# EAGLE design IMU Raspberry Pi Breakout RevB (EAGLE 9.6.2)
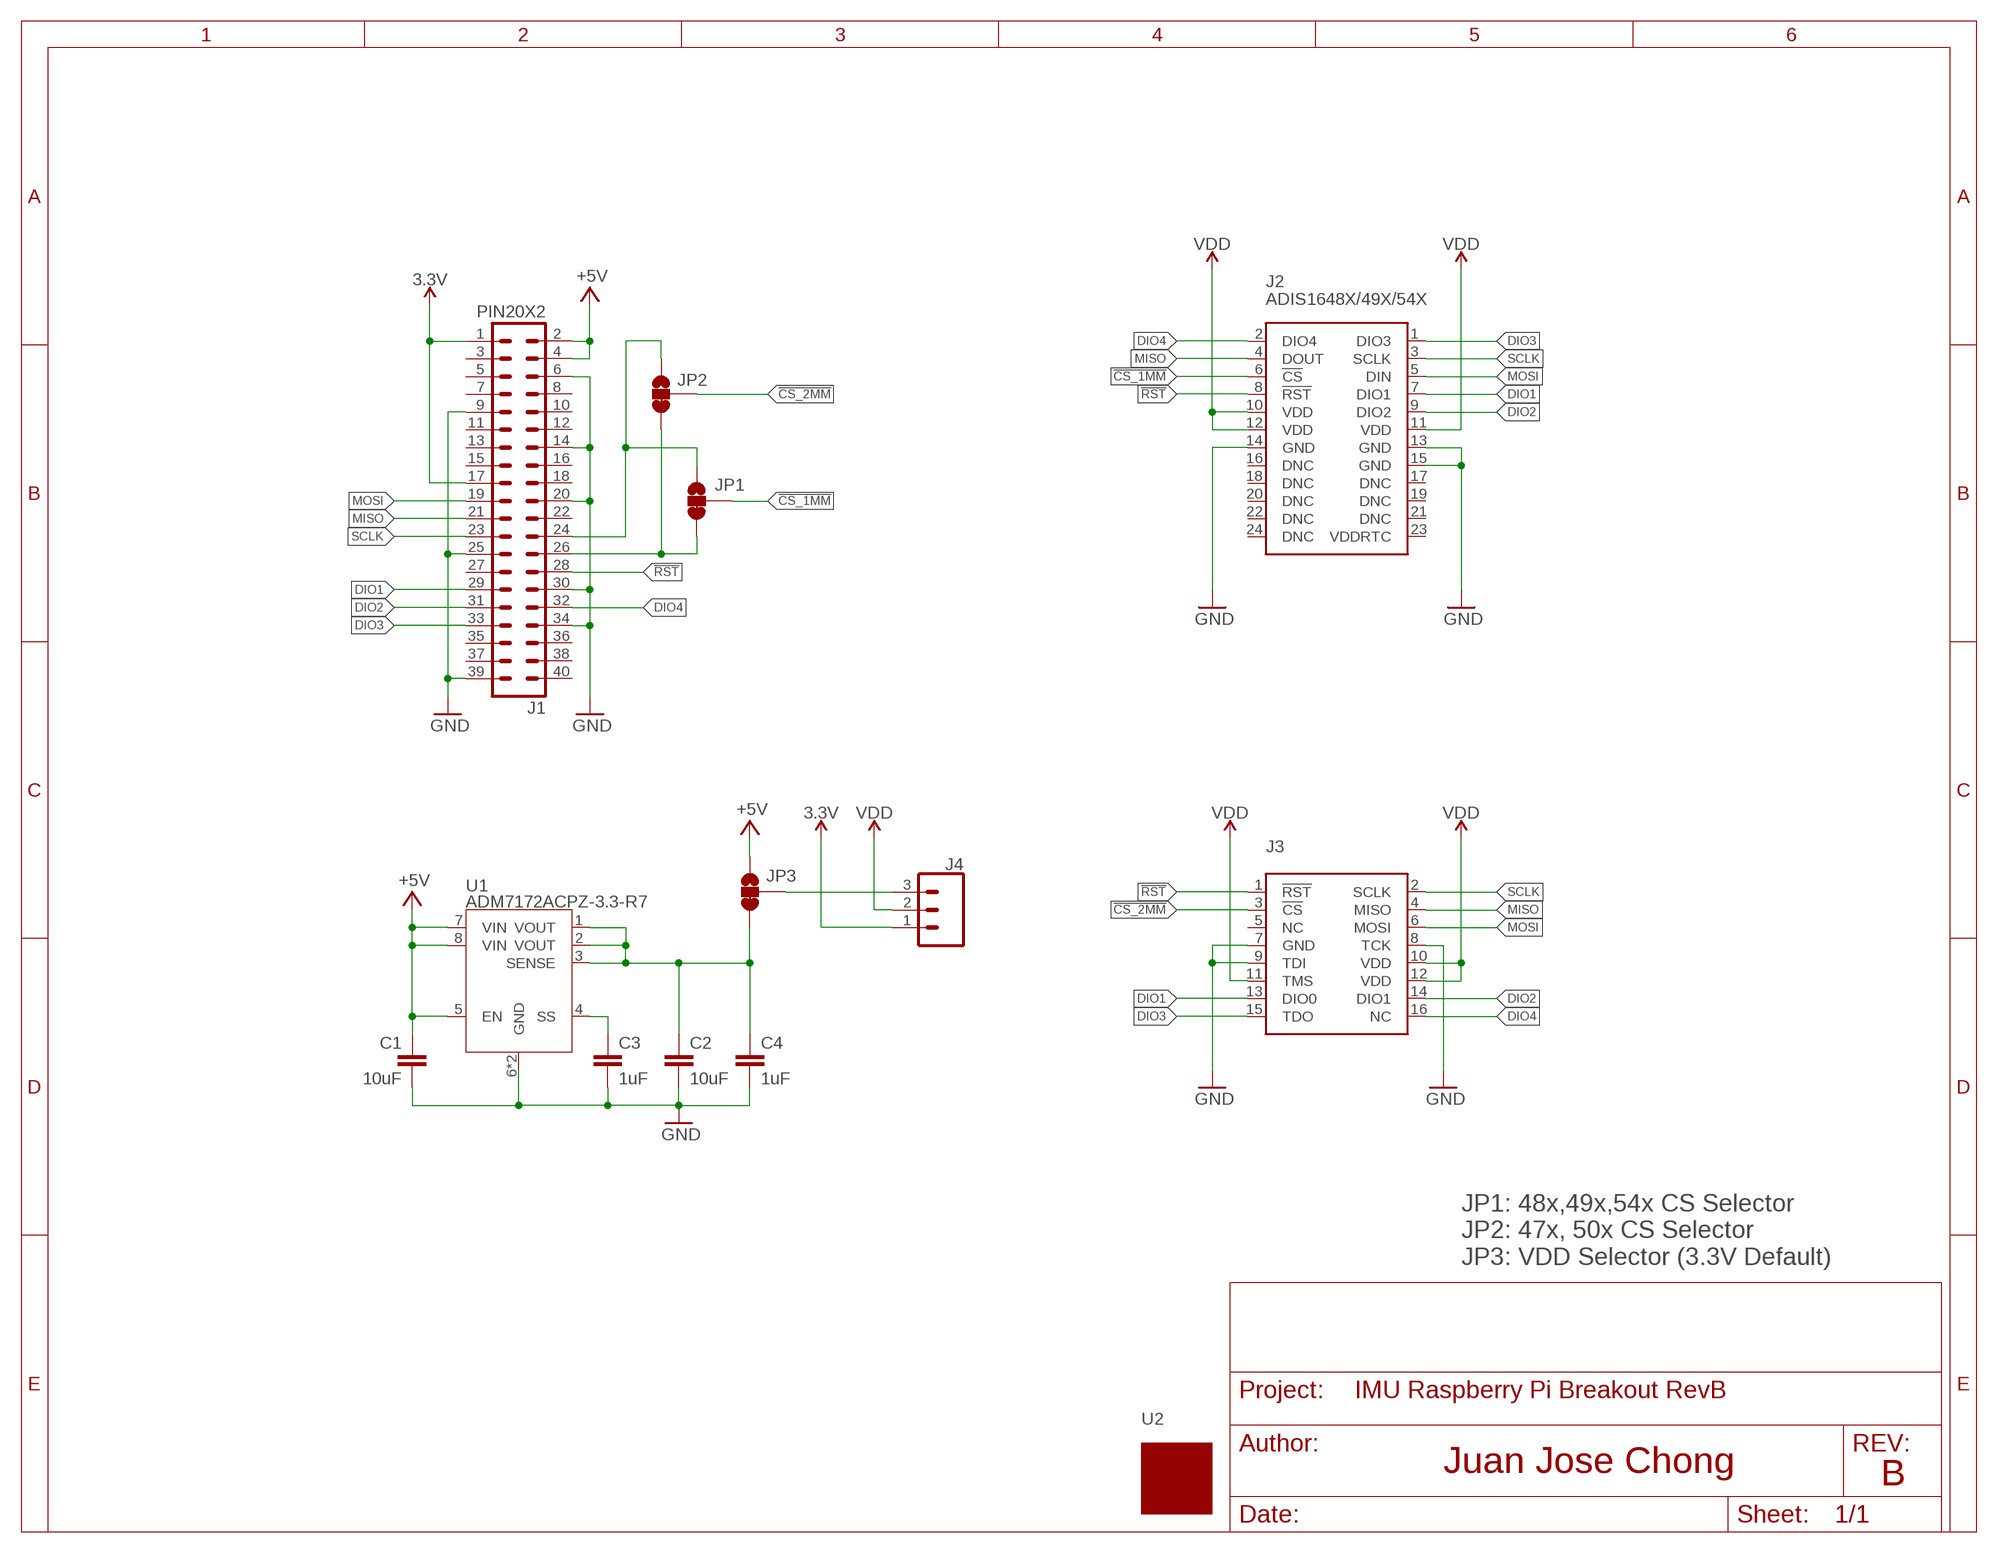
[diagram p0: schematic, sheet 1]

## Parts
C1  10uF  CAP-0805  [0805]
C2  10uF  CAP-0805  [0805]
C3  1uF  CAP-0603  [0603]
C4  1uF  CAP-0603  [0603]
J1  PIN20X2  [PIN_20X2]
J2  ADIS1648X/49X/54X  ADIS1648X/ADIS1649XTAPPED  [ADIS1648X-TAPPED]
J3  ADIS_EVAL_16PIN_2MM  [A3-16PA-2SV(71)-TOP]
J4  455-1750-1-ND  CONN_03  [1X03]
JP1  JUMPER-SMT_3_1-NC_TRACE_SILK  [SMT-JUMPER_3_1-NC_TRACE_SILK]
JP2  JUMPER-SMT_3_1-NC_TRACE_SILK  [SMT-JUMPER_3_1-NC_TRACE_SILK]
JP3  JUMPER-SMT_3_1-NC_TRACE_SILK  [SMT-JUMPER_3_1-NC_TRACE_SILK]
U1  ADM7172ACPZ-3.3-R7  [LFCSP-8]
U2  ADIS16XXX_COUPON  [ADIS16XXX_COUPON]

## Nets
3.3V: J1.1 J1.17 J4.1
!CS_1MM: J2.6(!CS) JP1.2
!CS_2MM: J3.3(!CS) JP2.2
!RST: J1.28 J2.8(!RST) J3.1(!RST)
+5V: C1.1 J1.2 J1.4 JP3.1 U1.5(EN) U1.7(VIN) U1.8(VIN)
DIO1: J1.29 J2.7(DIO1) J3.13(DIO0)
DIO2: J1.31 J2.9(DIO2) J3.14(DIO1)
DIO3: J1.33 J2.1(DIO3) J3.15(TDO)
DIO4: J1.32 J2.2(DIO4) J3.16(NC)
GND: C1.2 C2.2 C3.2 C4.2 J1.6 J1.9 J1.14 J1.20 J1.25 J1.30 J1.34 J1.39 J2.13(GND) J2.14(GND) J2.15(GND) J3.7(GND) J3.8(TCK) J3.9(TDI) U1.6(GND) U1.9(GND)
MISO: J1.21 J2.4(DOUT) J3.4(MISO)
MOSI: J1.19 J2.5(DIN) J3.6(MOSI)
N$1: C2.1 C4.1 JP3.3 U1.1(VOUT) U1.2(VOUT) U1.3(SENSE)
N$2: J1.26 JP1.3 JP2.3
N$3: J1.24 JP1.1 JP2.1
N$4: J4.3 JP3.2
N$6: C3.1 U1.4(SS)
SCLK: J1.23 J2.3(SCLK) J3.2(SCLK)
VDD: J2.10(VDD) J2.11(VDD) J2.12(VDD) J3.10(VDD) J3.11(TMS) J3.12(VDD) J4.2
Unconnected: J1.3 J1.5 J1.7 J1.8 J1.10 J1.11 J1.12 J1.13 J1.15 J1.16 J1.18 J1.22 J1.27 J1.35 J1.36 J1.37 J1.38 J1.40 J2.16(DNC) J2.17(DNC) J2.18(DNC) J2.19(DNC) J2.20(DNC) J2.21(DNC) J2.22(DNC) J2.23(VDDRTC) J2.24(DNC) J3.5(NC)

## Notes on the sheet
- JP1: 48x,49x,54x CS Selector
  JP2: 47x, 50x CS Selector
  JP3: VDD Selector (3.3V Default)
- B

## Library data of the parts
C1-C4 = SparkFun-Capacitors:CAP
J1 = FLYFISH:PIN20X2
J2 = ADI_iSensor_Footprints:ADIS1648X/ADIS1649X: ADIS1649x Tactical Grade, Six Degrees of Freedom Inertial Sensor The ADIS1649x is a complete inertial system that includes a triaxis gyroscope and a triaxis accelerometer. Each inertial sensor in the ADIS1649x combines industry leading iMEMS® technology with signal conditioning that optimizes dynamic performance. The factory calibration characterizes each sensor for sensitivity, bias, alignment, and linear acceleration (gyroscope bias). As a result, each sensor has its own dynamic compensation formulas that provide accurate sensor measurements. The ADIS1649x provides a simple, cost effective method for integrating accurate, multiaxis inertial sensing into industrial systems, especially when compared with the complexity and investment associated with discrete designs. All necessary motion testing and calibration are part of the production process at the factory, greatly reducing system integration time. Tight orthogonal alignment simplifies inertial frame alignment in navigation systems. The serial peripheral interface (SPI) and register structure provide a simple interface for data collection and configuration control. The footprint and connector system of the ADIS1649x is compatible with previous generations such as the ADIS16375, ADIS16480, ADIS16485, ADIS16488A, and ADIS16490. The ADIS1649x is available in an aluminum package that is approximately 47 mm × 44 mm × 14 mm and includes a standard connector interface. You are welcome to use this library for commercial purposes. For attribution, I ask that you reach out by sending me a link to the product being sold. My e-mail address is: juan@highcurrent.io
J3 = ADI_iSensor_Footprints:ADIS_EVAL_16PIN_2MM: ADIS 16-Pin Evaluation Header (2mm) This footprint is designed to mimic the 16-pin, 2mm header commonly found on iSensor coupon boards, evaluation boards, and breakout boards. You are welcome to use this library for commercial purposes. For attribution, I ask that you reach out by sending me a link to the product being sold. My e-mail address is: juan@highcurrent.io
J4 = SparkFun-Connectors:CONN_03: Multi connection point. Often used as Generic Header-pin footprint for 0.1 inch spaced/style header connections On any of the 0.1 inch spaced packages, you can populate with these: Break Away Headers - Straight <https://www.sparkfun.com/products/116> (PRT-00116) Break Away Male Headers - Right Angle <https://www.sparkfun.com/products/553> (PRT-00553) Female Headers <https://www.sparkfun.com/products/115> (PRT-00115) Break Away Headers - Machine Pin <https://www.sparkfun.com/products/117> (PRT-00117) Break Away Female Headers - Swiss Machine Pin <https://www.sparkfun.com/products/743> (PRT-00743) Stackable Header - 3 Pin (Female, 0.1") <https://www.sparkfun.com/products/13875> (PRT-13875) For SCREWTERMINALS and SPRING TERMINALS visit here: Screw Terimnals on SparkFun.com <https://www.sparkfun.com/search/results?term=Screw+Terminals> (5mm/3.5mm/2.54mm spacing) This device is also useful as a general connection point to wire up your design to another part of your project. Our various solder wires solder well into these plated through hole pads. Hook-Up Wire - Assortment (Stranded, 22 AWG) <https://www.sparkfun.com/products/11375> (PRT-11375) Hook-Up Wire - Assortment (Solid Core, 22 AWG) <https://www.sparkfun.com/products/11367> (PRT-11367) View the entire wire category on our website here <https://www.sparkfun.com/categories/141> Special notes: Molex polarized connector foot print use with SKU : PRT-08232 with associated crimp pins and housings.; PROD_ID: XXX-00000
JP1-JP3 = SparkFun-Jumpers:JUMPER-SMT_3_1-NC_TRACE: Normally closed trace jumper (1 of 2 connections) This jumper has a trace between two pads so it's normally closed (NC). The other connection is normally open (NO). Use a razor knife to open the connection. For best results follow the IPC guidelines for cutting traces: Cutout at least 0.063 mm (0.005 in). Remove all loose material to clean up the cut area. Seal the cut with an approved epoxy. Reapply solder to reclose the connection, or to close the NO connection.
U1 = AnalogDevices:ADM7172ACPZ
U2 = ADI_iSensor_Footprints:ADIS16XXX_COUPON

## Board
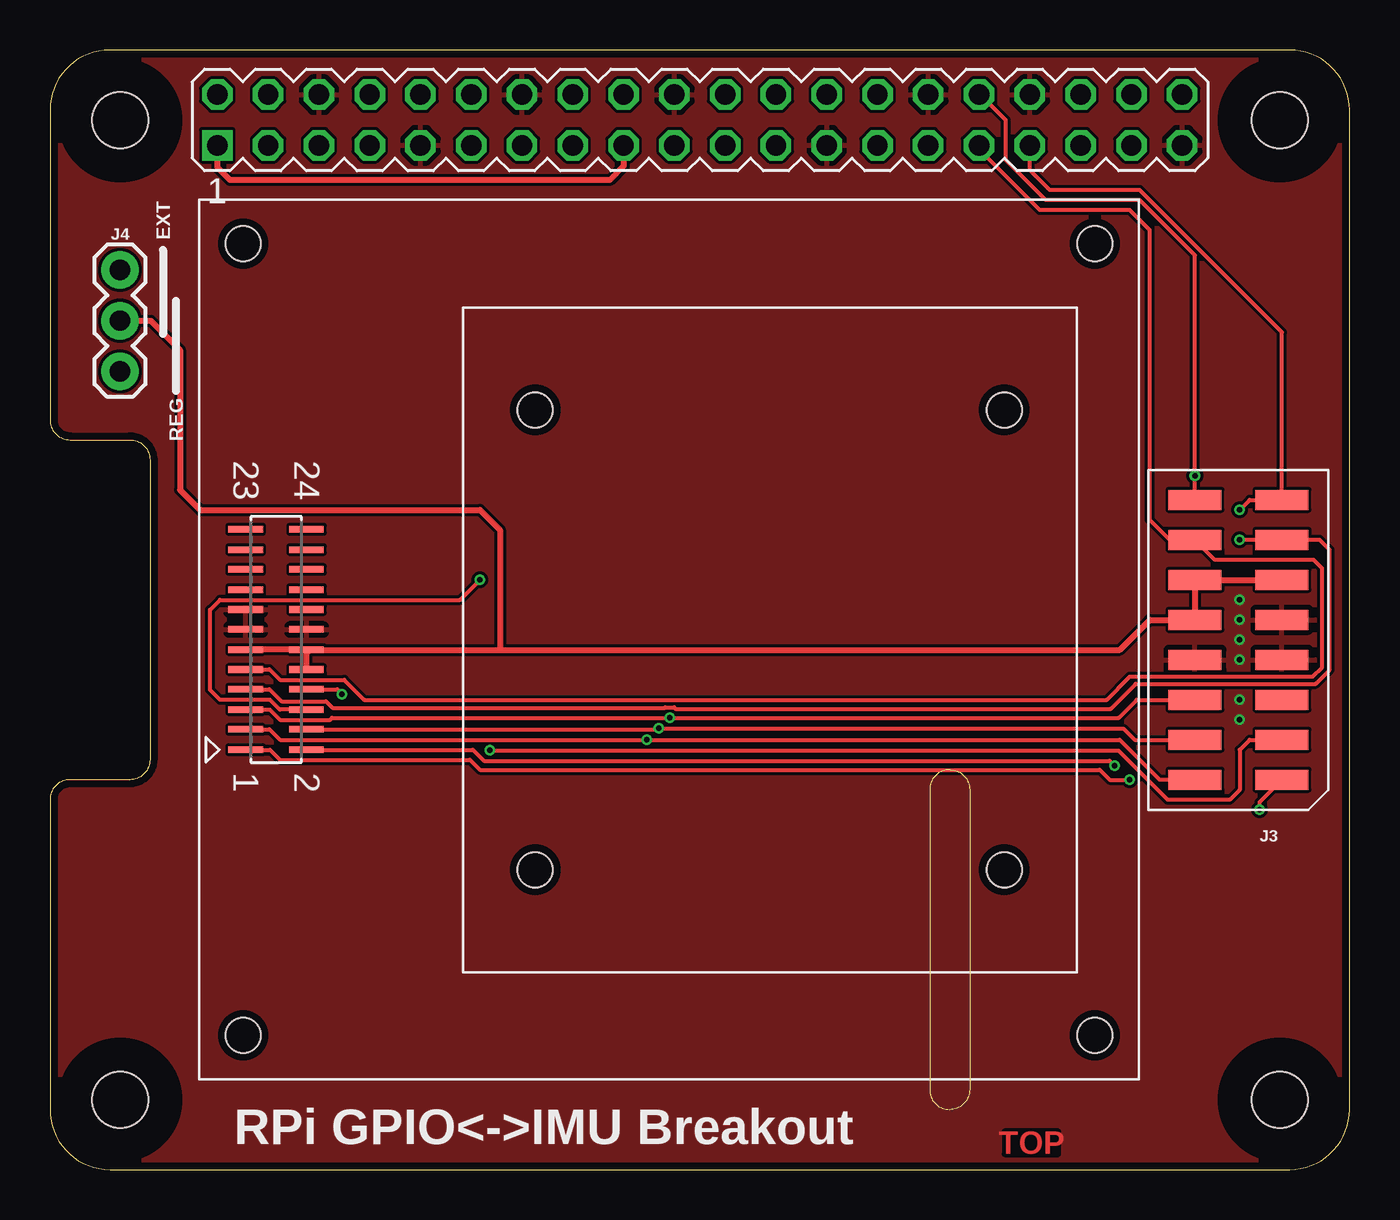
[diagram p1: board, top side]
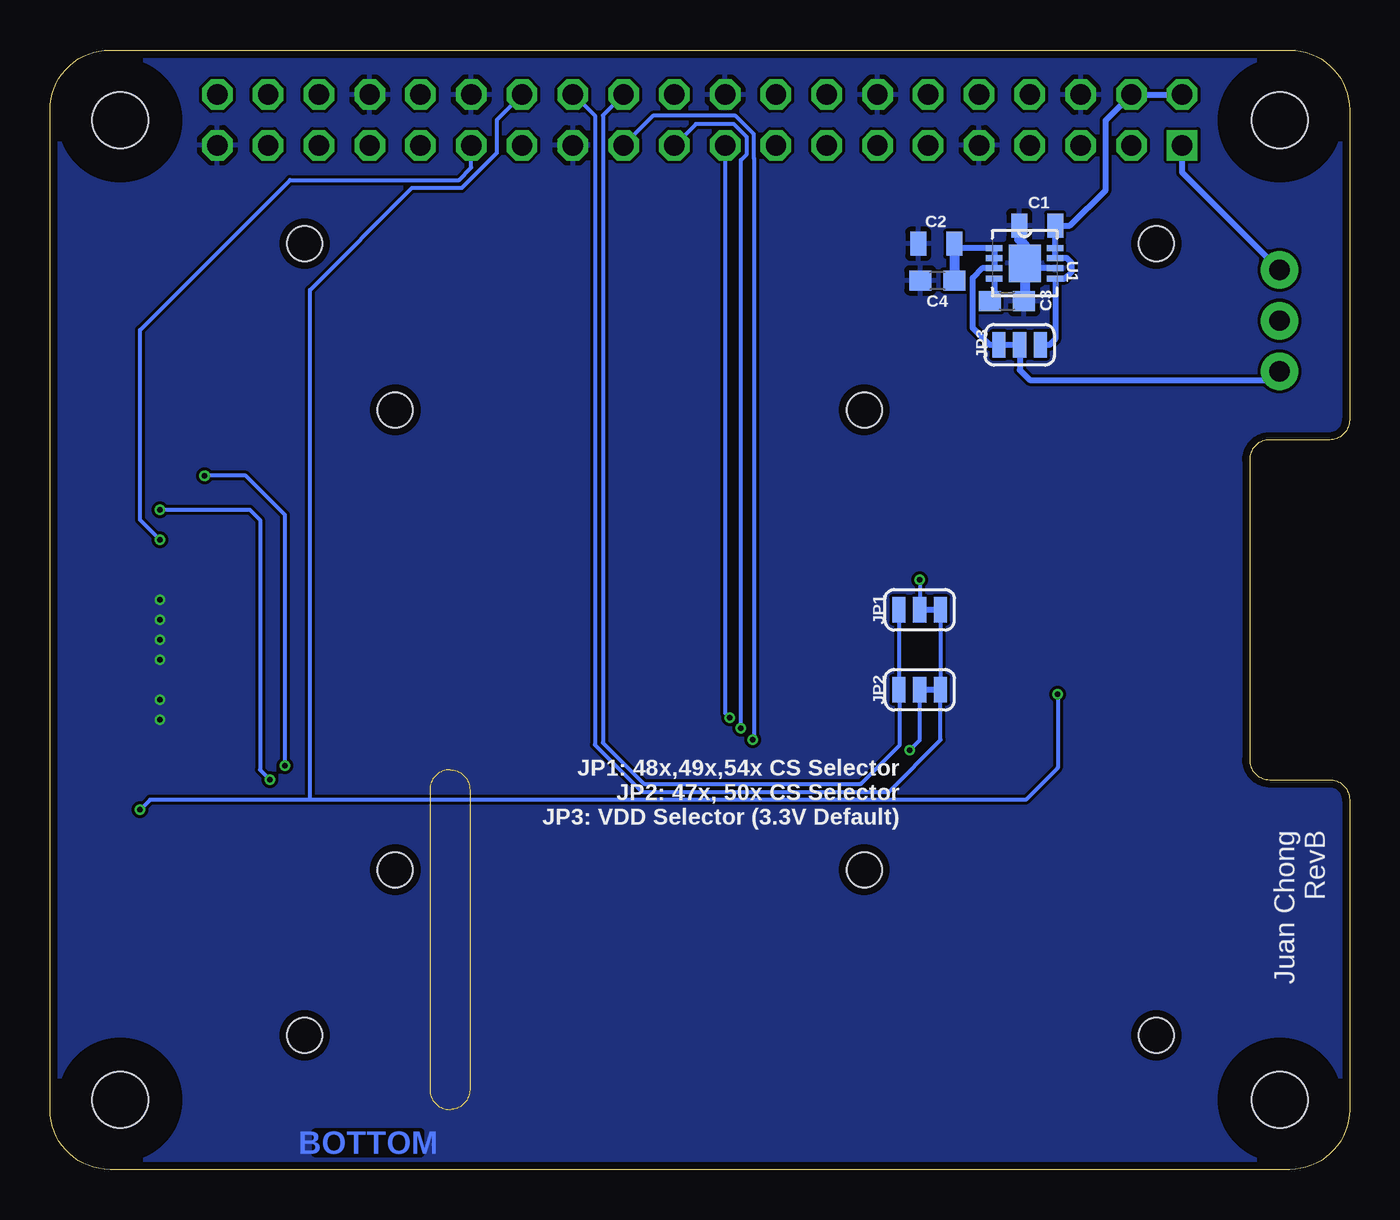
[diagram p2: board, bottom side, seen from below]

Size 65 x 56 mm. Coordinates in mm from the lower left corner, seen from the top.
Outline: 0,3 arc90 3,0 62,0 arc90 65,3 65,53 arc90 62,56 3,56 arc90 0,53 0,37.5 arc90 1,36.5 4,36.5 arc-90 5,35.5 5,20.5 arc-90 4,19.5 1,19.5 arc90 0,18.5 0,3
Copper layers (1*16): Top 0.035559375mm / dielectric 1.6mm / Bottom 0.035559375mm
Design rules "oshpark-2layer": minimum track width 6mil, minimum drill 10mil, track to track 6mil, track to pad 6mil, pad to pad 6mil, via to via 6mil, smd to smd 6mil, copper to edge 15mil, drill to drill 6mil, minimum pad ring 5mil, minimum via ring 5mil, stop-mask expansion 2.5mil, vias tented up to drill 0mil, thermal gap 10mil
Holes 2.8 mm at 3.5,3.5 3.5,52.5 61.5,52.5 61.5,3.5
tRestrict: area 1.9,51 to 5,54; area 60,51 to 63,54; area 60,1.9 to 63,5; area 1.9,1.9 to 5,5
bRestrict: area 1.9,1.9 to 5,5; area 1.9,51 to 5,54; area 60,1.9 to 63,5; area 60,51 to 63,54
Milling: 6 lines

### Footprints (pad centres in the part's own frame; a part is rotated, then mirrored left to right if it is on the bottom)
0805 = smd 0.8 x 1.2: 1 -0.9,0; 2 0.9,0
0603 = smd 1.1 x 1: 1 -0.85,0; 2 0.85,0
PIN_20X2 = drill 1.016 square: 1 -24.13,-1.27 | drill 1.016 octagon: 2 -24.13,1.27; 3 -21.59,-1.27; 4 -21.59,1.27; 5 -19.05,-1.27; 6 -19.05,1.27; 7 -16.51,-1.27; 8 -16.51,1.27; 9 -13.97,-1.27; 10 -13.97,1.27; 11 -11.43,-1.27; 12 -11.43,1.27; 13 -8.89,-1.27; 14 -8.89,1.27; 15 -6.35,-1.27; 16 -6.35,1.27; 17 -3.81,-1.27; 18 -3.81,1.27; 19 -1.27,-1.27; 20 -1.27,1.27; 21 1.27,-1.27; 22 1.27,1.27; 23 3.81,-1.27; 24 3.81,1.27; 25 6.35,-1.27; 26 6.35,1.27; 27 8.89,-1.27; 28 8.89,1.27; 29 11.43,-1.27; 30 11.43,1.27; 31 13.97,-1.27; 32 13.97,1.27; 33 16.51,-1.27; 34 16.51,1.27; 35 19.05,-1.27; 36 19.05,1.27; 37 21.59,-1.27; 38 21.59,1.27; 39 24.13,-1.27; 40 24.13,1.27
ADIS1648X-TAPPED = smd 0.33 x 1.727: 1 5.512,-1.524; 2 5.512,1.524; 3 4.496,-1.524; 4 4.496,1.524; 5 3.505,-1.524; 6 3.505,1.524; 7 2.489,-1.524; 8 2.489,1.524; 9 1.499,-1.524; 10 1.499,1.524; 11 0.508,-1.524; 12 0.508,1.524; 13 -0.508,-1.524; 14 -0.508,1.524; 15 -1.499,-1.524; 16 -1.499,1.524; 17 -2.489,-1.524; 18 -2.489,1.524; 19 -3.505,-1.524; 20 -3.505,1.524; 21 -4.496,-1.524; 22 -4.496,1.524; 23 -5.512,-1.524; 24 -5.512,1.524 | hole 1.75: -19.8,-1.642; 19.8,-1.642; 19.8,40.958; -19.8,40.958
A3-16PA-2SV(71)-TOP = smd 1 x 2.65: 1 -7,-2.225; 2 -7,2.125; 3 -5,-2.225; 4 -5,2.125; 5 -3,-2.225; 6 -3,2.125; 7 -1,-2.225; 8 -1,2.125; 9 1,-2.225; 10 1,2.125; 11 3,-2.225; 12 3,2.125; 13 5,-2.225; 14 5,2.125; 15 7,-2.225; 16 7,2.125
1X03 = drill 1.016 pad 1.88: 1 0,0; 2 2.54,0; 3 5.08,0
SMT-JUMPER_3_1-NC_TRACE_SILK = smd 0.66 x 1.27: 1 -1.041,0; 2 0,0; 3 1.041,0
LFCSP-8 = smd 0.813 x 0.305: 1 -1.524,0.762; 2 -1.524,0.254; 3 -1.524,-0.254; 4 -1.524,-0.762; 5 1.524,-0.762; 6 1.524,-0.254; 7 1.524,0.254; 8 1.524,0.762 | smd 1.6 x 1.88: 9 0,0
ADIS16XXX_COUPON = hole 1.75: -11.5,11.73; 11.5,11.73; 11.5,-11.73; -11.5,-11.73

### Placement (x,y rotation side)
C1  15.62,47.22 180 bottom
C2  20.67,46.31 180 bottom
C3  17.13,43.44 0 bottom
C4  20.62,44.47 180 bottom
J1  32.5,52.5 0 top
J2  11.31,26.51 270 top
J3  59.39,26.5 90 top
J4  3.5,45 270 top
JP1  21.5,28 0 bottom
JP2  21.5,24 0 bottom
JP3  16.5,41.25 180 bottom
U1  16.25,45.33 0 bottom
U2  36,26.5 90 top

### Tracks (layer width: path | path; a pad name or v marks a point on that pad's centre or on a via)
3.3V
  Top 0.3: J1.1 8.37,50.13 9,49.5 28,49.5 28.69,50.19 J1.17
  Bottom 0.3: J4.1 8.37,49.87 J1.1
!CS_1MM  (via drill 0.28)
  Top 0.2: J2.6 11.49,23.01 11,23.5 8.5,23.5 8,24 8,28 8.5,28.5 20.5,28.5 v21.5,29.5
  Bottom 0.2: v21.5,29.5 JP1.2
!CS_2MM  (via drill 0.28)
  Top 0.2: v22,20.98 22,20.95 53.45,20.95 55.9,18.5 59,18.5 59.5,19 59.5,21 60,21.5 J3.3
  Bottom 0.2: v22,20.98 21.5,21.48 JP2.2
!RST  (via drill 0.28)
  Top 0.2: J2.8 14.38,24.02 14.6,23.8 v14.6,23.78 | v60.5,18 60.5,18.39 J3.1
  Bottom 0.2: 52,18.5 16.2,18.5 14.6,20.1 v14.6,23.78 | 52,18.5 60,18.5 v60.5,18 | 52,18.5 52,44 46.9,49.1 44.4,49.1 42.65,50.85 42.65,52.51 J1.28
+5V
  Bottom 0.3: JP3.1 15.01,41.25 14.72,41.53 U1.5 14.23,44.57 13.9,44.9 13.9,45.35 14.15,45.6 U1.7 U1.8 C1.1 13.98,47.22 12.2,49 12.2,52.48 J1.4 J1.2
DIO1  (via drill 0.28)
  Top 0.2: J2.7 10.98,24.02 11.58,23.42 13.8,23.42 14.13,23.1 30.77,23.1 30.79,23.12 31.21,23.12 31.29,23.05 53.05,23.05 54.3,24.3 63.3,24.3 64,25 64,31 63.5,31.5 J3.13 v59.5,31.5
  Bottom 0.2: J1.29 43.93,50.12 44.55,49.5 53,49.5 60.5,42 60.5,32.5 v59.5,31.5
DIO2
  Top 0.2: J2.9 10.99,25.01 11.5,24.5 14.71,24.5 15.71,23.5 52.85,23.5 54,24.65 63.15,24.65 63.63,25.12 63.63,30.07 63.2,30.5 58.27,30.5 J3.14 56,31.5 55,32.5 55,47 54,48 49.5,48 46.47,51.03 J1.31
DIO3  (via drill 0.28)
  Top 0.2: J1.33 49.01,49.99 50,49 54.5,49 61.62,41.88 J3.15 60,33.5 v59.5,33 | J2.1 11,21 11.5,20.5 21,20.5 21.5,20 52.5,20 53,19.5 v54,19.5
  Bottom 0.2: v54,19.5 54.5,20 54.5,32.5 55,33 v59.5,33
DIO4  (via drill 0.28)
  Top 0.2: J3.16 v57.27,34.7 57.27,45.73 54.5,48.5 49.8,48.5 47.8,50.5 47.8,52.5 46.53,53.77 J1.32 | J2.2 21.15,21 21.7,20.45 53,20.45 v53.25,20.2
  Bottom 0.2: v53.25,20.2 53.25,32.75 55.2,34.7 v57.27,34.7
GND  (via drill 0.28)
  Bottom 0.3: U1.6 15.99,45.08 16.21,45.29 U1.9
  Bottom 0.508: U1.9 16.25,46.25 16.52,46.52 C1.2 | 16.21,45.29 16.23,45.27 16.23,43.49 C3.2
  other vias: 59.5,27.5 59.5,25.5 59.5,26.5 59.5,28.5 59.5,23.5 59.5,22.5
  pour Bottom: 0,3 arc90 3,0 62,0 arc90 65,3 65,53 arc90 62,56 3,56 arc90 0,53 0,37.5 arc90 1,36.5 4,36.5 arc-90 5,35.5 5,20.5 arc-90 4,19.5 1,19.5 arc90 0,18.5
  pour Top: 0,3 arc90 3,0 62,0 arc90 65,3 65,53 arc90 62,56 3,56 arc90 0,53 0,37.5 arc90 1,36.5 4,36.5 arc-90 5,35.5 5,20.5 arc-90 4,19.5 1,19.5 arc90 0,18.5
MISO  (via drill 0.28)
  Top 0.2: J3.4 54.25,21.5 53.72,22.03 30.5,22.03 v30.45,22.08 30.39,22.02 J2.4
  Bottom 0.2: v30.45,22.08 30.45,50.5 30.15,50.8 30.15,51.65 30.8,52.3 32.7,52.3 J1.21
MOSI  (via drill 0.28)
  Top 0.2: J2.5 10.99,23.01 11.5,22.5 14,22.5 14.1,22.6 v31,22.6 53.45,22.6 54.35,23.5 J3.6
  Bottom 0.2: J1.19 31.23,22.83 v31,22.6
N$1
  Bottom 0.3: C2.1 19.55,46.1 U1.1 U1.2 U1.3 18.37,45.08 18.85,44.6 18.85,42.1 18,41.25 JP3.3
  Bottom 0.508: C2.1 C4.1
N$2
  Bottom 0.2: JP1.3 JP2.3 20.46,21.49 23.05,18.9 35.4,18.9 37.75,21.25 37.75,52.72 38.8,53.77 J1.26
N$3
  Bottom 0.2: JP1.1 JP2.1 22.5,23.96 22.5,21.25 24.45,19.3 35.3,19.3 37.35,21.35 37.35,52.73 J1.24
N$4
  Bottom 0.3: JP3.2 16.5,40 16,39.5 3.92,39.5 J4.3
N$6
  Bottom 0.3: C3.1 17.77,43.65 U1.4
SCLK  (via drill 0.28)
  Top 0.2: J2.3 10.98,22.02 11.5,21.5 v29.85,21.5 53.5,21.5 55.5,19.5 J3.2
  Bottom 0.2: J1.23 34.85,52.7 30.7,52.7 29.8,51.8 29.8,50.6 29.8,21.55 v29.85,21.5
VDD
  Top 0.3: 13,26 J2.12 J2.11 | J2.10 12.84,25.84 13,26 | 13,26 22.5,26 | 22.5,26 53.5,26 55,27.5 J3.10 J3.12 J3.11 | J4.2 5.04,42.46 6.5,41 6.5,34 7.5,33 21.5,33 22.5,32 22.5,26

### Text on the board
Top: TOP
Bottom: BOTTOM
tPlace: EXT | REG
tNames: RPi GPIO<->IMU Breakout
bNames: JP1: 48x,49x,54x CS Selector / JP2: 47x, 50x CS Selector / JP3: VDD Selector (3.3V Default) | RevB | Juan Chong